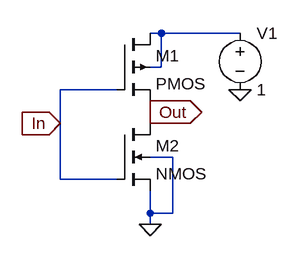
[diagram p0: schematic Not.asc]
Not.asc, the LTspice schematic file:
Version 4
SHEET 1 880 680
WIRE 240 48 224 48
WIRE 352 48 240 48
WIRE 240 96 240 48
WIRE 240 96 224 96
WIRE 176 128 96 128
WIRE 224 160 224 144
WIRE 96 176 96 128
WIRE 224 176 224 160
WIRE 256 224 224 224
WIRE 96 256 96 176
WIRE 176 256 96 256
WIRE 224 304 224 272
WIRE 256 304 256 224
WIRE 256 304 224 304
WIRE 224 320 224 304
FLAG 352 128 0
FLAG 224 320 0
FLAG 96 176 In
IOPIN 96 176 In
FLAG 224 160 Out
IOPIN 224 160 Out
SYMBOL pmos4 176 48 R0
SYMATTR InstName M1
SYMATTR Value2 l=130n w=2u
SYMBOL nmos4 176 176 R0
SYMATTR InstName M2
SYMATTR Value2 l=130n w=1u
SYMBOL voltage 352 32 R0
WINDOW 123 0 0 Left 0
WINDOW 39 0 0 Left 0
SYMATTR InstName V1
SYMATTR Value 1

The netlist it stands for:
* Not.asc
M1 N001 In Out N001 PMOS l=130n w=2u
M2 Out In 0 0 NMOS l=130n w=1u
V1 N001 0 1
.model NMOS NMOS
.model PMOS PMOS
.lib standard.mos
.backanno
.end